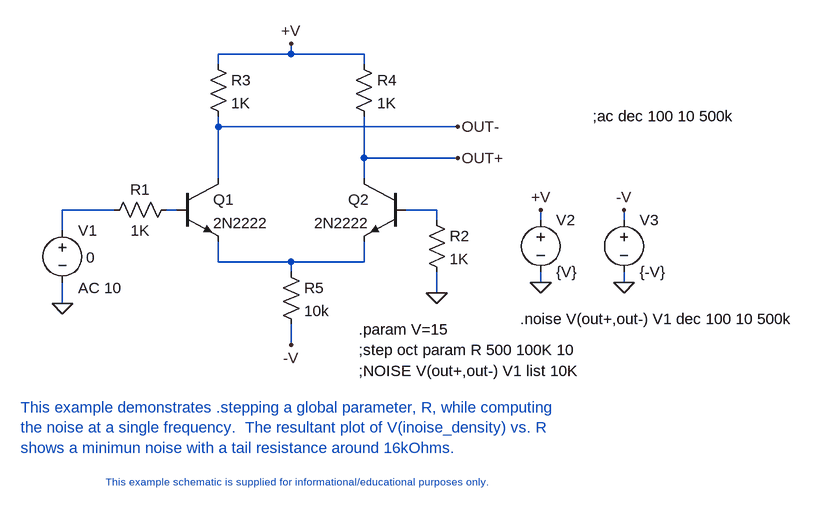
[diagram p0: schematic ejemploruido.asc]
ejemploruido.asc, the LTspice schematic file:
Version 4
SHEET 1 2900 1632
WIRE 2112 864 2112 848
WIRE 2112 864 2000 864
WIRE 2224 864 2112 864
WIRE 2000 880 2000 864
WIRE 2224 880 2224 864
WIRE 2000 976 2000 960
WIRE 2368 976 2000 976
WIRE 2224 1024 2224 960
WIRE 2368 1024 2224 1024
WIRE 2000 1056 2000 976
WIRE 2224 1056 2224 1024
WIRE 1840 1104 1760 1104
WIRE 1936 1104 1920 1104
WIRE 2336 1104 2288 1104
WIRE 2336 1120 2336 1104
WIRE 2496 1120 2496 1104
WIRE 2624 1120 2624 1104
WIRE 1760 1136 1760 1104
WIRE 2000 1184 2000 1152
WIRE 2112 1184 2000 1184
WIRE 2224 1184 2224 1152
WIRE 2224 1184 2112 1184
WIRE 2112 1200 2112 1184
WIRE 2496 1216 2496 1200
WIRE 2624 1216 2624 1200
WIRE 2336 1232 2336 1200
WIRE 1760 1248 1760 1216
WIRE 2112 1312 2112 1280
FLAG 2496 1216 0
FLAG 2624 1216 0
FLAG 1760 1248 0
FLAG 2624 1104 -V
FLAG 2496 1104 +V
FLAG 2112 1312 -V
FLAG 2112 848 +V
FLAG 2368 976 OUT-
FLAG 2368 1024 OUT+
FLAG 2336 1232 0
SYMBOL voltage 2496 1104 R0
SYMATTR InstName V2
SYMATTR Value {V}
SYMBOL voltage 2624 1104 R0
SYMATTR InstName V3
SYMATTR Value {-V}
SYMBOL res 1936 1088 R90
WINDOW 0 0 56 VBottom 2
WINDOW 3 32 56 VTop 2
SYMATTR InstName R1
SYMATTR Value 1K
SYMBOL voltage 1760 1120 R0
WINDOW 3 37 57 Left 2
WINDOW 39 0 0 Left 2
WINDOW 123 24 104 Left 2
SYMATTR Value 0
SYMATTR Value2 AC 10
SYMATTR InstName V1
SYMBOL npn 1936 1056 R0
SYMATTR InstName Q1
SYMATTR Value 2N2222
SYMBOL npn 2288 1056 M0
SYMATTR InstName Q2
SYMATTR Value 2N2222
SYMBOL res 1984 864 R0
SYMATTR InstName R3
SYMATTR Value 1K
SYMBOL res 2208 864 R0
SYMATTR InstName R4
SYMATTR Value 1K
SYMBOL res 2096 1184 R0
SYMATTR InstName R5
SYMATTR Value 10k
SYMBOL res 2320 1104 R0
SYMATTR InstName R2
SYMATTR Value 1K
TEXT 2216 1352 Left 2 !;NOISE V(out+,out-) V1 list 10K
TEXT 2216 1288 Left 2 !.param V=15
TEXT 2216 1320 Left 2 !;step oct param R 500 100K 10
TEXT 1696 1408 Left 2 ;This example demonstrates .stepping a global parameter, R, while computing\nthe noise at a single frequency.  The resultant plot of V(inoise_density) vs. R\nshows a minimun noise with a tail resistance around 16kOhms.
TEXT 2112 1512 Top 1 ;This example schematic is supplied for informational/educational purposes only.
TEXT 2576 960 Left 2 !;ac dec 100 10 500k
TEXT 2464 1272 Left 2 !.noise V(out+,out-) V1 dec 100 10 500k

The netlist it stands for:
* ejemploruido.asc
V2 +V 0 {V}
V3 -V 0 {-V}
R1 N002 N001 1K
V1 N001 0 0 AC 10
Q1 OUT- N002 N004 0 2N2222
Q2 OUT+ N003 N004 0 2N2222
R3 +V OUT- 1K
R4 +V OUT+ 1K
R5 N004 -V 10k
R2 N003 0 1K
.model NPN NPN
.model PNP PNP
.lib standard.bjt
;NOISE V(out+,out-) V1 list 10K
.param V=15
;step oct param R 500 100K 10
* This example demonstrates .stepping a global parameter, R, while computing
* the noise at a single frequency.  The resultant plot of V(inoise_density) vs. R
* shows a minimun noise with a tail resistance around 16kOhms.
* This example schematic is supplied for informational/educational purposes only.
;ac dec 100 10 500k
.noise V(out+,out-) V1 dec 100 10 500k
.backanno
.end